# EasyEDA Pro project comparatorVCO.eprj, schematic IO_1
Board Name: IO_alt; Create Date: 2025-12-15; Page Name: P1; Project Name: comparatorVCO; Schematic Name: IO_1; Update Date: 2025-12-15; Company: EasyEDA.com; Page Size: A4; Version: V1.0
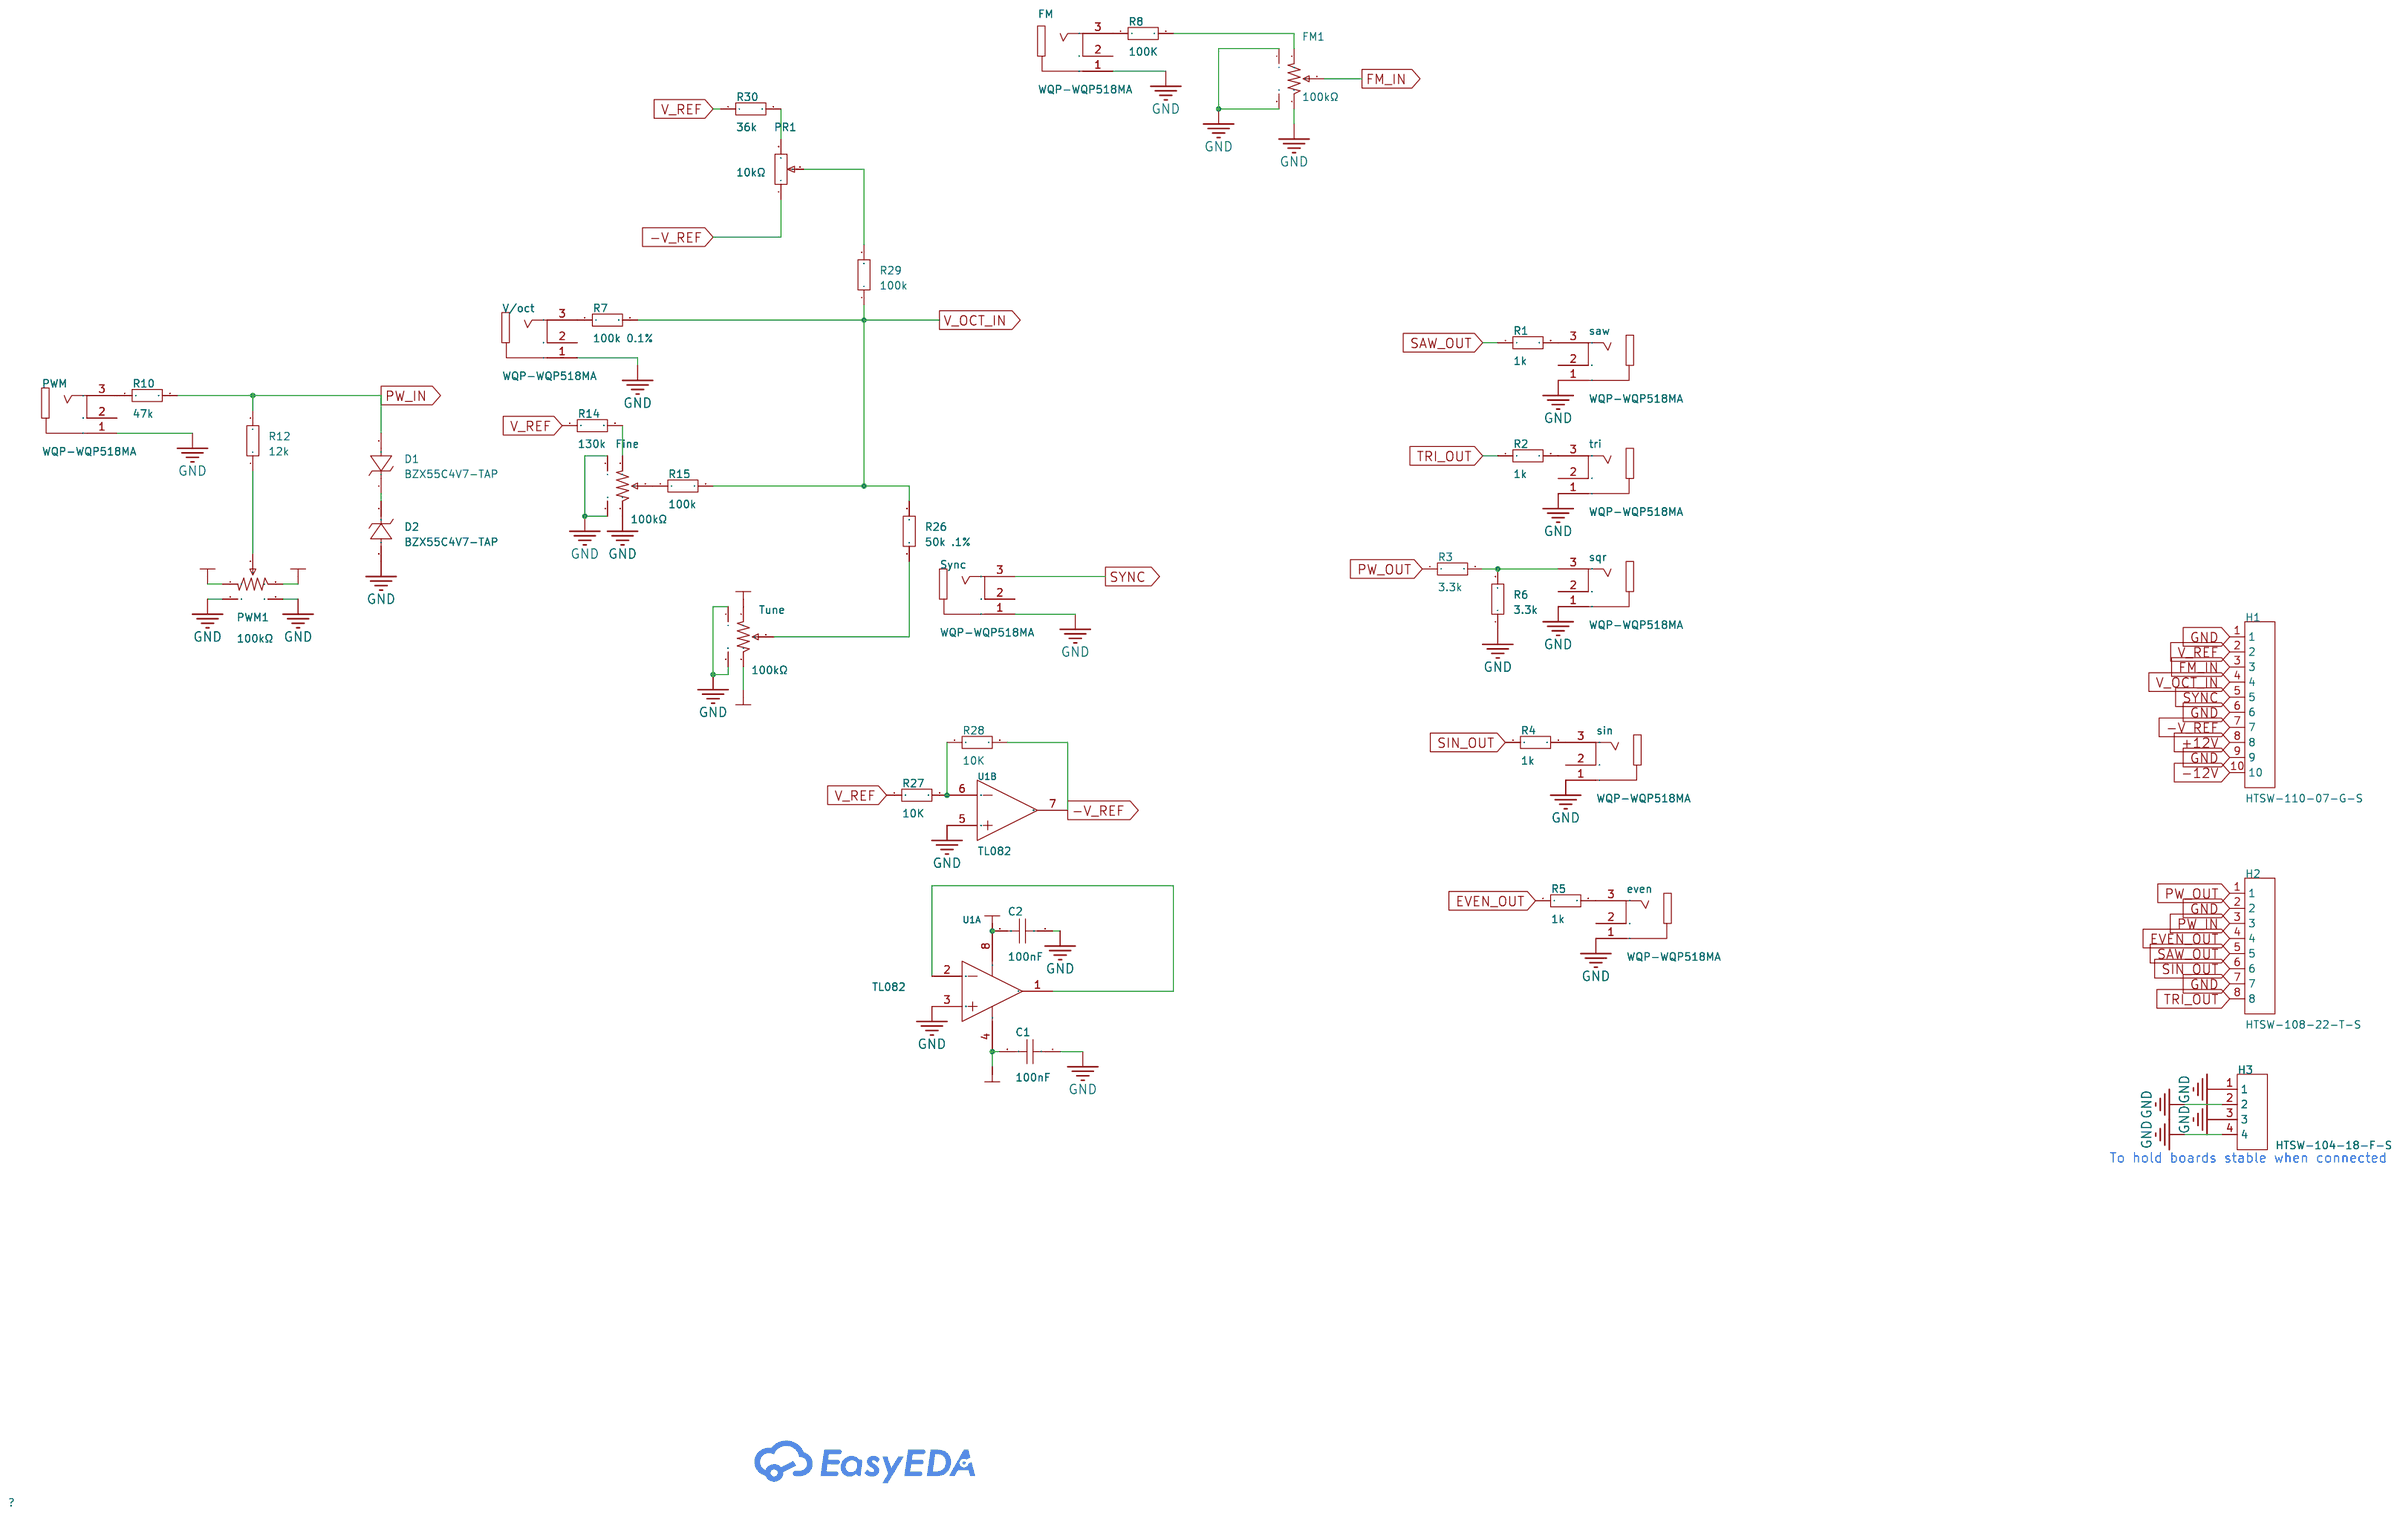
[diagram p2: schematic sheet]

## Parts
C1  100nF  [C0603]
C2  100nF  [C0603]
D1  BZX55C4V7-TAP  [DO-35_BD1.7-L3.8-P7.8-D0.5-FD]
D2  BZX55C4V7-TAP  [DO-35_BD1.7-L3.8-P7.8-D0.5-FD]
even  WQP-WQP518MA  [CONN-TH_WQP-WQP518MA]
Fine  100kΩ  [RES-ADJ-TH_RK09D1130C3C]
FM  WQP-WQP518MA  [CONN-TH_WQP-WQP518MA]
FM1  100kΩ  [RES-ADJ-TH_RK09D1130C3C]
H1  HTSW-110-07-G-S  [HDR-TH_TSW-110-17-F-S-LL]
H2  HTSW-108-22-T-S  [HDR-TH_HTSW-108-22-T-S]
H3  HTSW-104-18-F-S  [HDR-TH_HTSW-104-25-S-S-LL]
PR1  10kΩ  [RES-ADJ-TH_3P-L10.0-W10.0-P2.50-L]
PWM  WQP-WQP518MA  [CONN-TH_WQP-WQP518MA]
PWM1  100kΩ  [RES-ADJ-TH_RK09D1130C3C]
R1  1k  [R0603]
R2  1k  [R0603]
R3  3.3k  [R0603]
R4  1k  [R0603]
R5  1k  [R0603]
R6  3.3k  [R0603]
R7  100k 0.1%  [R0603]
R8  100K  [R0603]
R10  47k  [R0603]
R12  12k  [R0603]
R14  130k  [R0603]
R15  100k  [R0603]
R26  50k .1%  [R0603]
R27  10K  [R0603]
R28  10K  [R0603]
R29  100k  [R0603]
R30  36k  [R0603]
saw  WQP-WQP518MA  [CONN-TH_WQP-WQP518MA]
sin  WQP-WQP518MA  [CONN-TH_WQP-WQP518MA]
sqr  WQP-WQP518MA  [CONN-TH_WQP-WQP518MA]
Sync  WQP-WQP518MA  [CONN-TH_WQP-WQP518MA]
tri  WQP-WQP518MA  [CONN-TH_WQP-WQP518MA]
Tune  100kΩ  [RES-ADJ-TH_RK09D1130C3C]
U1  TL082  [SOP-8_L4.9-W3.9-P1.27-LS6.0-BL]  (sections 1,2)
V/oct  WQP-WQP518MA  [CONN-TH_WQP-WQP518MA]

## Library data of the parts
C1 C2 = CAP_0603: Supplier Footprint: 0603
D1 D2 = BZX55C4V7-TAP: LCSC Part Name: 独立式 耐压:4.7V 电流:0.5uA; Supplier Part: C5584224; Manufacturer: VISHAY(威世); Supplier Footprint: DO-35(DO-204AH); JLCPCB Part Class: Extended Part; Datasheet: https://item.szlcsc.com/datasheet/BZX55C4V7-TAP/6502633.html; Supplier: LCSC; Diode Configuration: Independent; Zener Voltage(Nom): 4.7V; Reverse Leakage Current (Ir): 500nA; Zener Voltage(Range): 4.4V~5V; Pd - Power Dissipation: 500mW; Impedance(Zzt): 9Ω; Impedance(Zzk): 600Ω
even FM PWM saw sin sqr Sync tri V/oct = WQP-WQP518MA: Supplier Part: C53058333; Manufacturer: 青浦电子; JLCPCB Part Class: Extended Part; Datasheet: https://item.szlcsc.com/datasheet/WQP-WQP518MA/56007154.html; Supplier: LCSC
Fine FM1 PWM1 Tune = RK09D1130A1N: LCSC Part Name: 10kΩ ±20%; Supplier Part: C470306; Manufacturer: ALPSALPINE(阿尔卑斯阿尔派); Supplier Footprint: 插件; Datasheet: https://item.szlcsc.com/datasheet/RK09D1130A1N/476386.html; Supplier: LCSC; Tolerance: ±20%; Voltage Rating: 20V; Power(Watts): 50mW
H1 = HTSW-110-07-G-S: LCSC Part Name: 间距:2.54mm 直插; Supplier Part: C7286348; Manufacturer: SAMTEC; Supplier Footprint: 插件,P=2.54mm; JLCPCB Part Class: Extended Part; Datasheet: https://item.szlcsc.com/datasheet/HTSW-110-07-G-S/8255757.html; Supplier: LCSC; Pitch: 2.54mm; Mounting Type: Through Hole; Number of Rows: 1; Number of Pins: 10P; Contact Material: Phosphor Bronze; Contact Plating: Gold; Operating Temperature: -55℃~+125℃
H2 = HTSW-108-22-T-S: LCSC Part Name: 间距:2.54mm 直插; Supplier Part: C6877799; Manufacturer: SAMTEC; Supplier Footprint: 插件,P=2.54mm; Datasheet: https://item.szlcsc.com/datasheet/HTSW-108-22-T-S/7841687.html; Supplier: LCSC; Pitch: 2.54mm; Mounting Type: Through Hole; Number of Rows: 1; Number of Pins: 8P; Contact Material: Phosphor Bronze; Contact Plating: Tin; Operating Temperature: -55℃~+105℃
H3 = HTSW-104-18-F-S: LCSC Part Name: 间距:2.54mm 直插; Supplier Part: C7286115; Manufacturer: SAMTEC; Supplier Footprint: 插件,P=2.54mm; JLCPCB Part Class: Extended Part; Datasheet: https://item.szlcsc.com/datasheet/HTSW-104-18-F-S/8255523.html; Supplier: LCSC; Pitch: 2.54mm; Mounting Type: Through Hole; Number of Rows: 1; Number of Pins: 4P; Contact Material: Phosphor Bronze; Contact Plating: Tin; Operating Temperature: -55℃~+125℃
PR1 = R_3296: Supplier Footprint: Through
R1-R8 R10 R12 R14 R15 R26-R30 = Res_0603: Supplier Footprint: 0603
U1 = TL082: Supplier Part: C5157699; Manufacturer: Gcore(扬州国芯); Supplier Footprint: SOP-8; JLCPCB Part Class: Extended Part; Datasheet: https://item.szlcsc.com/datasheet/TL082/5796627.html; Supplier: LCSC; Gain Bandwidth Product: 3MHz; Ib - Input Bias Current: 2.5nA; Vos - Input Offset Voltage: 3mV; Common Mode Rejection Ratio(CMRR): 85dB; Slew Rate: 13V/us; Quiescent Current(Iq): 1.4mA

## Nets
+12V: C2.2 H1.8 PWM1.1 Tune.1 U1.8(VCC+)
-12V: C1.2 H1.10 PWM1.3 Tune.3 U1.4(VCC-)
GND: C1.1 C2.1 D2.2(A) even.1 Fine.3 Fine.4 Fine.5 FM.1 FM1.3 FM1.4 FM1.5 H1.1 H1.6 H1.9 H2.2 H2.7 H3.1 H3.2 H3.3 H3.4 PWM.1 PWM1.4 PWM1.5 R6.1 saw.1 sin.1 sqr.1 Sync.1 tri.1 Tune.4 Tune.5 U1.3(1IN+) U1.5(2IN+) V/oct.1
-V_REF: H1.7 PR1.1 R28.2 U1.7(2OUT)
EVEN_OUT: H2.4 R5.1
FM_IN: FM1.2 H1.3
PW_IN: D1.2(A) H2.3 R10.2 R12.2
PW_OUT: H2.1 R3.1
SAW_OUT: H2.5 R1.1
SIN_OUT: H2.6 R4.1
SYNC: H1.5 Sync.3
TRI_OUT: H2.8 R2.1
V_OCT_IN: H1.4 R7.2 R15.2 R26.2 R29.1
V_REF: H1.2 R14.1 R27.1 R30.1
$1N379: R1.2 saw.3
$1N459: R2.2 tri.3
$1N485: R3.2 R6.2 sqr.3
$1N511: R4.2 sin.3
$1N537: even.3 R5.2
$1N977: R7.1 V/oct.3
$1N1003: FM.3 R8.1
$1N1055: PWM.3 R10.1
$1N1199: PWM1.2 R12.1
$1N1336: D1.1(K) D2.1(K)
$1N1602: Fine.1 R14.2
$1N1651: Fine.2 R15.1
$1N2918: R27.2 R28.1 U1.6(2IN-)
$1N3569: R26.1 Tune.2
$1N5861: PR1.2 R29.2
$1N5947: PR1.3 R30.2
$1N8161: U1.1(1OUT) U1.2(1IN-)
$1N8571: FM1.1 R8.2

Not connected (* = marked no-connect by the designer): even 2; FM 2; PWM 2; saw 2; sin 2; sqr 2; Sync 2; tri 2; V/oct 2

## Notes on the sheet
- To hold boards stable when connected
